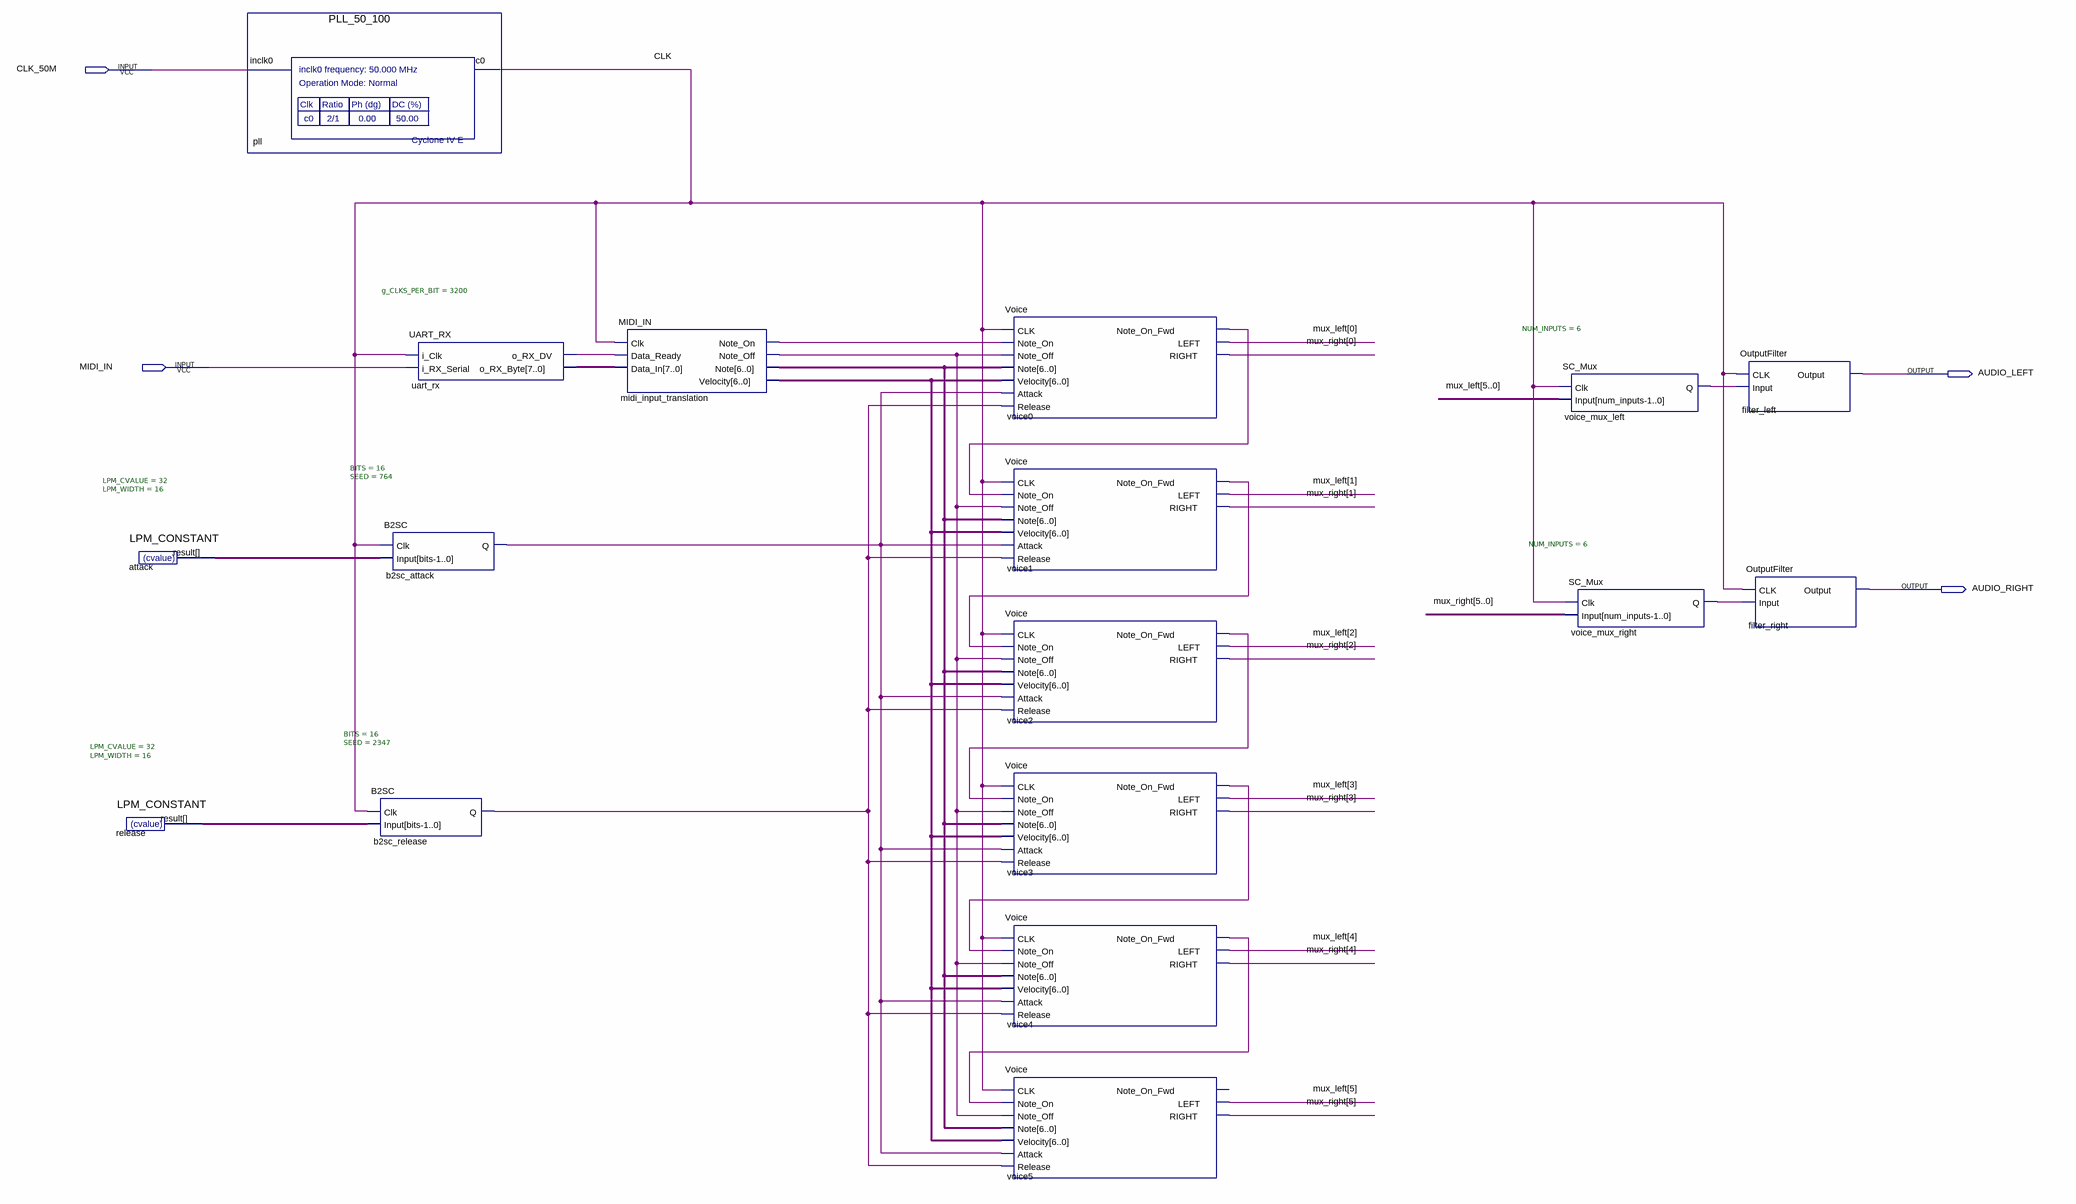
[diagram p0: schematic sheet]
// Quartus schematic stochastic_fpga_synth.bdf as structural Verilog: 17 symbols, 4 pins
module stochastic_fpga_synth (
  input  CLK_50M,
  input  MIDI_IN,
  output AUDIO_LEFT,
  output AUDIO_RIGHT
);

  wire b2sc_attack_q, b2sc_release_q, CLK, midi_input_translation_note_off, midi_input_translation_note_on,
       uart_rx_o_rx_dv, voice0_note_on_fwd, voice1_note_on_fwd, voice2_note_on_fwd, voice3_note_on_fwd,
       voice4_note_on_fwd, voice_mux_left_q, voice_mux_right_q;
  wire [5:0] mux_left, mux_right;
  wire [6:0] midi_input_translation_note, midi_input_translation_velocity;
  wire [7:0] uart_rx_o_rx_byte;
  wire [15:0] attack_result, release_result;

  LPM_CONSTANT #(.LPM_CVALUE(32), .LPM_WIDTH(16)) attack (.result(attack_result));
  LPM_CONSTANT #(.LPM_CVALUE(32), .LPM_WIDTH(16)) \release  (.result(release_result));
  PLL_50_100 pll (.inclk0(CLK_50M), .c0(CLK));
  B2SC #(.BITS(16), .SEED(764)) b2sc_attack (.Clk(CLK), .Input(attack_result), .Q(b2sc_attack_q));
  B2SC #(.BITS(16), .SEED(2347)) b2sc_release (.Clk(CLK), .Input(release_result), .Q(b2sc_release_q));
  UART_RX #(.g_CLKS_PER_BIT(3200)) uart_rx (
    .i_Clk(CLK), .i_RX_Serial(MIDI_IN), .o_RX_DV(uart_rx_o_rx_dv), .o_RX_Byte(uart_rx_o_rx_byte));
  MIDI_IN midi_input_translation (
    .Clk(CLK), .Data_Ready(uart_rx_o_rx_dv), .Data_In(uart_rx_o_rx_byte),
    .Note_On(midi_input_translation_note_on), .Note_Off(midi_input_translation_note_off),
    .Note(midi_input_translation_note), .Velocity(midi_input_translation_velocity));
  Voice voice0 (
    .CLK(CLK), .Note_On(midi_input_translation_note_on), .Note_Off(midi_input_translation_note_off),
    .Note(midi_input_translation_note), .Velocity(midi_input_translation_velocity), .Attack(b2sc_attack_q),
    .Release(b2sc_release_q), .Note_On_Fwd(voice0_note_on_fwd), .LEFT(mux_left[0]), .RIGHT(mux_right[0]));
  Voice voice1 (
    .CLK(CLK), .Note_On(voice0_note_on_fwd), .Note_Off(midi_input_translation_note_off),
    .Note(midi_input_translation_note), .Velocity(midi_input_translation_velocity), .Attack(b2sc_attack_q),
    .Release(b2sc_release_q), .Note_On_Fwd(voice1_note_on_fwd), .LEFT(mux_left[1]), .RIGHT(mux_right[1]));
  Voice voice2 (
    .CLK(CLK), .Note_On(voice1_note_on_fwd), .Note_Off(midi_input_translation_note_off),
    .Note(midi_input_translation_note), .Velocity(midi_input_translation_velocity), .Attack(b2sc_attack_q),
    .Release(b2sc_release_q), .Note_On_Fwd(voice2_note_on_fwd), .LEFT(mux_left[2]), .RIGHT(mux_right[2]));
  Voice voice3 (
    .CLK(CLK), .Note_On(voice2_note_on_fwd), .Note_Off(midi_input_translation_note_off),
    .Note(midi_input_translation_note), .Velocity(midi_input_translation_velocity), .Attack(b2sc_attack_q),
    .Release(b2sc_release_q), .Note_On_Fwd(voice3_note_on_fwd), .LEFT(mux_left[3]), .RIGHT(mux_right[3]));
  Voice voice4 (
    .CLK(CLK), .Note_On(voice3_note_on_fwd), .Note_Off(midi_input_translation_note_off),
    .Note(midi_input_translation_note), .Velocity(midi_input_translation_velocity), .Attack(b2sc_attack_q),
    .Release(b2sc_release_q), .Note_On_Fwd(voice4_note_on_fwd), .LEFT(mux_left[4]), .RIGHT(mux_right[4]));
  Voice voice5 (
    .CLK(CLK), .Note_On(voice4_note_on_fwd), .Note_Off(midi_input_translation_note_off),
    .Note(midi_input_translation_note), .Velocity(midi_input_translation_velocity), .Attack(b2sc_attack_q),
    .Release(b2sc_release_q), .LEFT(mux_left[5]), .RIGHT(mux_right[5]));  // open: Note_On_Fwd
  SC_Mux #(.NUM_INPUTS(6)) voice_mux_left (.Clk(CLK), .Input(mux_left), .Q(voice_mux_left_q));
  SC_Mux #(.NUM_INPUTS(6)) voice_mux_right (.Clk(CLK), .Input(mux_right), .Q(voice_mux_right_q));
  OutputFilter filter_left (.CLK(CLK), .Input(voice_mux_left_q), .Output(AUDIO_LEFT));
  OutputFilter filter_right (.CLK(CLK), .Input(voice_mux_right_q), .Output(AUDIO_RIGHT));
endmodule
